# Altium schematic sheet GPS_NEOM8M.SchDoc
size A4; SheetNumber: 3; SheetTotal: 6
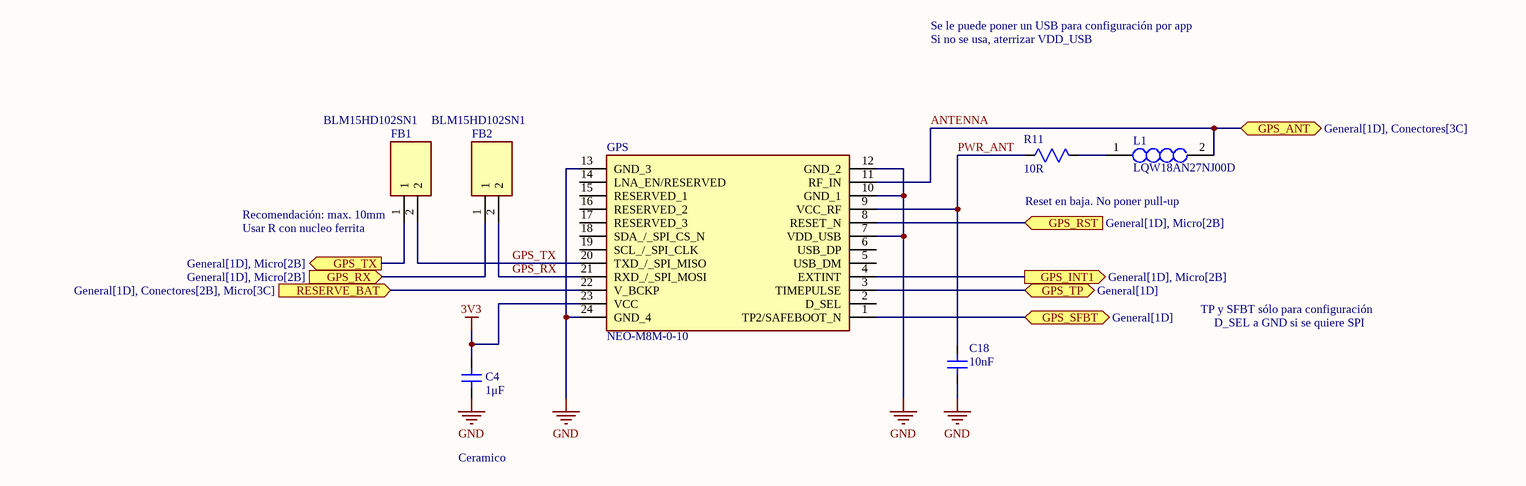
[diagram p0: GPS_NEOM8M.SchDoc]

## Parts
C4  Valor: 1μF  [CAP SMD 0805]  (hidden comment: CAP_0805_1uF)
C18  Valor: 10nF  [CAP SMD 0805]  (hidden comment: CAP_0805_1uF)
FB1  BLM15HD102SN1  [NFZ15SG152SN10B]
FB2  BLM15HD102SN1  [NFZ15SG152SN10B]
GPS  NEO-M8M-0-10  [NEO-M8T]
L1  LQW18AN27NJ00D  [LQW18AS10NG0CD]
R11  Valor: 10R  [RES SMD 0805]  (hidden comment: RES_0805_10k)

## Ports
GPS_ANT (bidir, see General[1D], Conectores[3C]), GPS_INT1 (out, see General[1D], Micro[2B]), GPS_RST (in, see General[1D], Micro[2B]), GPS_RX (in, see General[1D], Micro[2B]), GPS_SFBT (bidir, see General[1D]), GPS_TP (bidir, see General[1D]), GPS_TX (out, see General[1D], Micro[2B]), RESERVE_BAT (in, see General[1D], Conectores[2B], Micro[3C])

## Nets
3V3: C4.1 GPS.23(VCC)
GND: C4.2 C18.1 GPS.7(VDD_USB) GPS.10(GND_1) GPS.12(GND_2) GPS.13(GND_3) GPS.24(GND_4)
ANTENNA: GPS.11(RF_IN) L1.2 ; port GPS_ANT
GPS_INT1: GPS.4(EXTINT) ; port GPS_INT1
GPS_RST: GPS.8(RESET_N) ; port GPS_RST
GPS_RX: FB2.2 GPS.21(RXD_/_SPI_MOSI)
GPS_RX: FB2.1 ; port GPS_RX  [a separate net that carries the same name]
GPS_SFBT: GPS.1(TP2/SAFEBOOT_N) ; port GPS_SFBT
GPS_TP: GPS.3(TIMEPULSE) ; port GPS_TP
GPS_TX: FB1.2 GPS.20(TXD_/_SPI_MISO)
GPS_TX: FB1.1 ; port GPS_TX  [a separate net that carries the same name]
PWR_ANT: C18.2 GPS.9(VCC_RF) R11.1
RESERVE_BAT: GPS.22(V_BCKP) ; port RESERVE_BAT
NetL1_1: L1.1 R11.2

Not connected (* = marked no-connect by the designer): GPS 2(D_SEL) 5(USB_DM) 6(USB_DP) 14(LNA_EN/RESERVED) 15(RESERVED_1) 16(RESERVED_2) 17(RESERVED_3) 18(SDA_/_SPI_CS_N) 19(SCL_/_SPI_CLK)

## Notes on the sheet
- Se le puede poner un USB para configuración por app
- Si no se usa, aterrizar VDD_USB
- (near FB1) Recomendación: max. 10mm
- (near FB1) Usar R con nucleo ferrita
- Reset en baja. No poner pull-up
- TP y SFBT sólo para configuración
- D_SEL a GND si se quiere SPI
- Ceramico

## Library data of the parts
C4 C18 = CMP-081-000001-1: Condensador 0805 1uF; Distribuidor: -; RefFabricante: -; ComponentLink2URL: -; RefDistribuidor: -; ComponentLink2Description: Datasheet; ComponentLink1Description: Link-Compra; Design Item ID: CAP_0805_1uF; Source: ARUS2021.SchLib; Fabricante: -; ComponentLink1URL: -
FB1 FB2 = BLM15HD102SN1: Ferrite Bead; Manufacturer_Name: Murata Electronics; Datasheet Link: http://www.murata.com/~/media/webrenewal/support/library/catalog/products/emc/emifil/c31e.ashx?la=en-gb; Height: 0.55mm; Manufacturer_Part_Number: BLM15HD102SN1; Mouser Part Number: N/A; Mouser Price/Stock: https://www.mouser.co.uk/ProductDetail/Murata-Electronics/BLM15HD102SN1?qs=%2F7R%2FnUXKGoiRMnYJExxoAg%3D%3D
GPS = NEO-M8M-0-10: Integrated Circuit; Manufacturer_Name: U-Blox; Datasheet Link: https://www.u-blox.com/sites/default/files/NEO-M8-FW3_DataSheet_%28UBX-15031086%29.pdf; Manufacturer_Part_Number: NEO-M8M-0-10
L1 = LQW18AN27NJ00D: Inductor; Manufacturer_Name: Murata Electronics; Datasheet Link: https://psearch.en.murata.com/inductor/product/LQW18AN27NJ00%23.html; Height: 1mm; Manufacturer_Part_Number: LQW18AN27NJ00D; Mouser Part Number: 81-LQW18AN27NJ00D; Mouser Price/Stock: https://www.mouser.com/Search/Refine.aspx?Keyword=81-LQW18AN27NJ00D; Arrow Part Number: LQW18AN27NJ00D; Arrow Price/Stock: https://www.arrow.com/en/products/lqw18an27nj00d/murata-manufacturing
R11 = CMP-088-000003-1: Resistencia 0805 10k; Distribuidor: -; Fabricante: -; Design Item ID: RES_0805_10k; ComponentLink1Description: Link-Compra; RefDistribuidor: -; ComponentLink2Description: Datasheet; Source: ARUS2021.SchLib; ComponentLink1URL: -; RefFabricante: -; ComponentLink2URL: -